# EAGLE design xiaogyan.v1.1 (EAGLE 7.7.0)
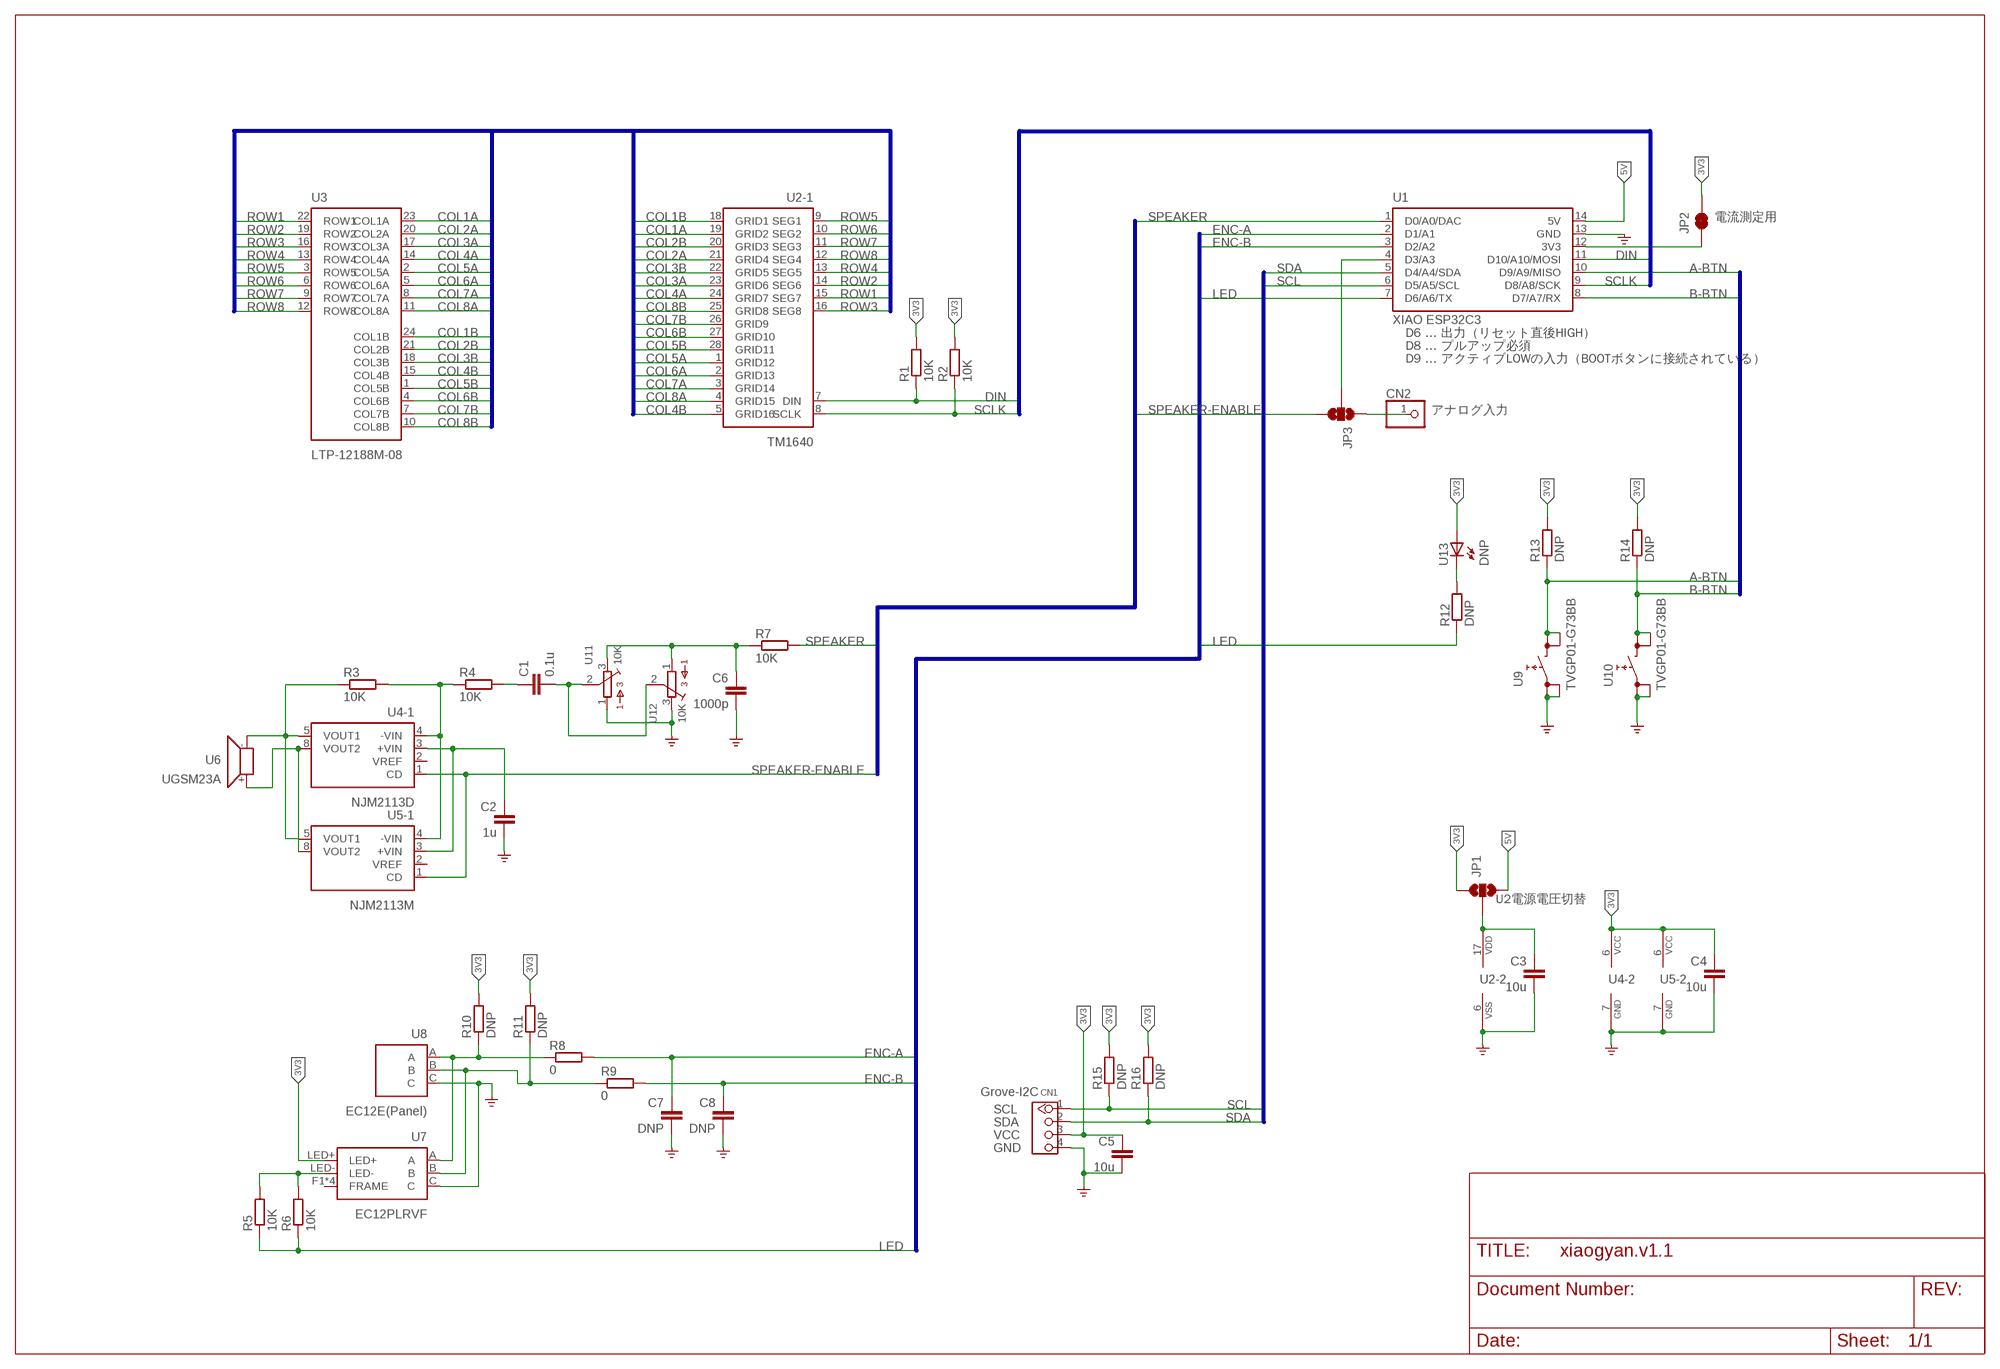
[diagram p0: schematic, sheet 1]

## Parts
C1  0.1u  C-EUC0603  [C0603]
C2  1u  C-EUC0603  [C0603]
C3  10u  C-EUC0603  [C0603]
C4  10u  C-EUC0603  [C0603]
C5  10u  C-EUC0603  [C0603]
C6  1000p  C-EUC0805  [C0805]
C7  DNP  C-EUC0603  [C0603]
C8  DNP  C-EUC0603  [C0603]
CN1  4P-2.0  GROVE-CONNECTOR-DIP(4P-2.0)  [HW4-2.0]
CN2  PINHD-1X1  [1X01]
JP1  JUMPER-SMT_3_NO_SILK  [SMT-JUMPER_3_NO_SILK]
JP2  JUMPER-SMT_2_NC_TRACE_SILK  [SMT-JUMPER_2_NC_TRACE_SILK]
JP3  JUMPER-SMT_3_NO_SILK  [SMT-JUMPER_3_NO_SILK]
R1  10K  R-EU_R0603  [R0603]
R2  10K  R-EU_R0603  [R0603]
R3  10K  R-EU_R0603  [R0603]
R4  10K  R-EU_R0603  [R0603]
R5  10K  R-EU_R0603  [R0603]
R6  10K  R-EU_R0603  [R0603]
R7  10K  R-EU_R0603  [R0603]
R8  0  R-EU_R0603  [R0603]
R9  0  R-EU_R0603  [R0603]
R10  DNP  R-EU_R0603  [R0603]
R11  DNP  R-EU_R0603  [R0603]
R12  DNP  R-EU_R0603  [R0603]
R13  DNP  R-EU_R0603  [R0603]
R14  DNP  R-EU_R0603  [R0603]
R15  DNP  R-EU_R0603  [R0603]
R16  DNP  R-EU_R0603  [R0603]
U1  XIAO ESP32C3  SEEEDUINOXIAO  [SEEEDUINOXIAO]
U2  TM1640  [TM1640]
U3  LTP-12188M-08  [LTP-12188M]
U4  NJM2113D  [DIL08]
U5  NJM2113M  [SO08]
U6  UGSM23A  [UGSM23A]
U7  EC12PLRVF  [EC12PLRVF]
U8  EC12E(Panel)  EC12EPANEL  [EC12E_PANEL]
U9  TVGP01-G73BB  [TVGP01-G73BB]
U10  TVGP01-G73BB  [TVGP01-G73BB]
U11  10K  3386-K  [3386K]
U12  10K  3386-T  [3386T]
U13  DNP  LED5MM  [LED5MM]

## Nets
3V3: C4.1 C5.1 CN1.3 JP1.1 JP2.2 R1.2 R2.2 R10.2 R11.2 R13.2 R14.2 R15.2 R16.2 U4.6(-2:VCC) U5.6(-2:VCC) U7.LED+ U13.A
5V: JP1.3 U1.14(5V)
A-BTN: R13.1 U1.10(D9/A9/MISO) U9.3 U9.4
B-BTN: R14.1 U1.8(D7/A7/RX) U10.3 U10.4
COL1A: U2.19(-1:GRID2) U3.23(COL1A)
COL1B: U2.18(-1:GRID1) U3.24(COL1B)
COL2A: U2.21(-1:GRID4) U3.20(COL2A)
COL2B: U2.20(-1:GRID3) U3.21(COL2B)
COL3A: U2.23(-1:GRID6) U3.17(COL3A)
COL3B: U2.22(-1:GRID5) U3.18(COL3B)
COL4A: U2.24(-1:GRID7) U3.14(COL4A)
COL4B: U2.5(-1:GRID16) U3.15(COL4B)
COL5A: U2.1(-1:GRID12) U3.2(COL5A)
COL5B: U2.28(-1:GRID11) U3.1(COL5B)
COL6A: U2.2(-1:GRID13) U3.5(COL6A)
COL6B: U2.27(-1:GRID10) U3.4(COL6B)
COL7A: U2.3(-1:GRID14) U3.8(COL7A)
COL7B: U2.26(-1:GRID9) U3.7(COL7B)
COL8A: U2.4(-1:GRID15) U3.11(COL8A)
COL8B: U2.25(-1:GRID8) U3.10(COL8B)
DIN: R1.1 U1.11(D10/A10/MOSI) U2.7(-1:DIN)
ENC-A: C7.1 R8.2 U1.2(D1/A1)
ENC-B: C8.1 R9.2 U1.3(D2/A2)
GND: C2.2 C3.2 C4.2 C5.2 C6.2 C7.2 C8.2 CN1.4 U1.13(GND) U2.6(-2:VSS) U4.7(-2:GND) U5.7(-2:GND) U7.C U8.C U9.1 U9.2 U10.1 U10.2 U11.1 U12.3 ; supply symbol labelled GND_POWER
LED: R5.1 R6.1 R12.1 U1.7(D6/A6/TX)
N$1: R3.1 U4.5(-1:VOUT1) U5.5(-1:VOUT1) U6.-
N$2: R3.2 R4.1 U4.4(-1:-VIN) U5.4(-1:-VIN)
N$3: U4.8(-1:VOUT2) U5.8(-1:VOUT2) U6.+
N$4: C1.1 R4.2
N$5: C2.1 U4.3(-1:+VIN) U5.3(-1:+VIN)
N$6: R5.2 R6.2 U7.LED-
N$7: R8.1 R10.1 U7.A U8.A
N$8: C1.2 U11.2 U12.2
N$9: R9.1 R11.1 U7.B U8.B
N$10: C6.1 R7.1 U11.3 U12.1
N$11: R12.2 U13.K(C)
N$12: JP3.2 U1.4(D3/A3)
N$13: C3.1 JP1.2 U2.17(-2:VDD)
N$15: JP2.1 U1.12(3V3)
N$16: CN2.1 JP3.1
ROW1: U2.15(-1:SEG7) U3.22(ROW1)
ROW2: U2.14(-1:SEG6) U3.19(ROW2)
ROW3: U2.16(-1:SEG8) U3.16(ROW3)
ROW4: U2.13(-1:SEG5) U3.13(ROW4)
ROW5: U2.9(-1:SEG1) U3.3(ROW5)
ROW6: U2.10(-1:SEG2) U3.6(ROW6)
ROW7: U2.11(-1:SEG3) U3.9(ROW7)
ROW8: U2.12(-1:SEG4) U3.12(ROW8)
SCL: CN1.1 R15.1 U1.6(D5/A5/SCL)
SCLK: R2.1 U1.9(D8/A8/SCK) U2.8(-1:SCLK)
SDA: CN1.2 R16.1 U1.5(D4/A4/SDA)
SPEAKER: R7.2 U1.1(D0/A0/DAC)
SPEAKER-ENABLE: JP3.3 U4.1(-1:CD) U5.1(-1:CD)
Unconnected: U4.2(-1:VREF) U5.2(-1:VREF) U7.F1(FRAME) U7.F2(FRAME) U7.F3(FRAME) U7.F4(FRAME)

## Buses
DIN,SCLK
ROW[1..8],COL1A,COL2A,COL3A,COL4A,COL5A,COL6A,COL7A,COL8A,COL1B,COL2B,COL3B,COL4B,COL5B,COL6B,COL7B,COL8B
SPEAKER,SPEAKER-ENABLE
ENC-A,ENC-B,LED
A-BTN,B-BTN
SCL,SDA

## Notes on the sheet
- 電流測定用
- D6 ... 出力（リセット直後HIGH）
- D8 ... プルアップ必須
- D9 ... アクティブLOWの入力（BOOTボタンに接続されている）
- アナログ入力
- U2電源電圧切替
- Grove-I2C
- SCL
- SDA
- VCC
- GND

## Library data of the parts
C1-C8 = rcl:C-EU: CAPACITOR, European symbol
CN1 = Seeed-Connector:GROVE-CONNECTOR-DIP(4P-2.0): 320110033
CN2 = pinhead:PINHD-1X1: PIN HEADER
JP1 JP3 = SparkFun-Jumpers:JUMPER-SMT_3_NO: Normally open jumper This jumper has three pads in close proximity to each other. Apply solder to close the connection(s).
JP2 = SparkFun-Jumpers:JUMPER-SMT_2_NC_TRACE: Normally closed trace jumper This jumper has a trace between two pads so it's normally closed (NC). Use a razor knife to open the connection. For best results follow the IPC guidelines for cutting traces: Cutout at least 0.063 mm (0.005 in). Remove all loose material to clean up the cut area. Seal the cut with an approved epoxy. Reapply solder to reclose the connection.
R1-R16 = rcl:R-EU_: RESISTOR, European symbol
U1 = matsujirushi:SEEEDUINOXIAO
U2 = matsujirushi:TM1640; OC_AKIZUKI: I-13225
U3 = matsujirushi:LTP-12188M; OC_AKIZUKI: I-09878
U4 = matsujirushi:NJM2113; OC_AKIZUKI: I-11192
U5 = matsujirushi:NJM2113
U6 = matsujirushi:UGSM23A; OC_AKIZUKI: P-09797
U7 = matsujirushi:EC12PL*VF; OC_AKIZUKI: P-05762
U8 = matsujirushi:EC12E
U9 U10 = matsujirushi:TVGP01-G73BB; OC_AKIZUKI: P-12226
U11 U12 = pot-suntan:3386-: Trimming Potentiometer Suntan TSR-3386 Series 8 Terminal Square Trimming Potentiometer
U13 = led:LED: LED OSRAM: - CHIPLED LG R971, LG N971, LY N971, LG Q971, LY Q971, LO R971, LY R971 LH N974, LH R974 LS Q976, LO Q976, LY Q976 LO Q996 - Hyper CHIPLED LW Q18S LB Q993, LB Q99A, LB R99A - SideLED LS A670, LO A670, LY A670, LG A670, LP A670 LB A673, LV A673, LT A673, LW A673 LH A674 LY A675 LS A676, LA A676, LO A676, LY A676, LW A676 LS A679, LY A679, LG A679 - Hyper Micro SIDELED® LS Y876, LA Y876, LO Y876, LY Y876 LT Y87S - SmartLED LW L88C, LW L88S LB L89C, LB L89S, LG L890 LS L89K, LO L89K, LY L89K LS L896, LA L896, LO L896, LY L896 - TOPLED LS T670, LO T670, LY T670, LG T670, LP T670 LSG T670, LSP T670, LSY T670, LOP T670, LYG T670 LG T671, LOG T671, LSG T671 LB T673, LV T673, LT T673, LW T673 LH T674 LS T676, LA T676, LO T676, LY T676, LB T676, LH T676, LSB T676, LW T676 LB T67C, LV T67C, LT T67C, LS T67K, LO T67K, LY T67K, LW E67C LS E67B, LA E67B, LO E67B, LY E67B, LB E67C, LV E67C, LT E67C LW T67C LS T679, LY T679, LG T679 LS T770, LO T770, LY T770, LG T770, LP T770 LB T773, LV T773, LT T773, LW T773 LH T774 LS E675, LA E675, LY E675, LS T675 LS T776, LA T776, LO T776, LY T776, LB T776 LHGB T686 LT T68C, LB T68C - Hyper Mini TOPLED® LB M676 - Mini TOPLED Santana® LG M470 LS M47K, LO M47K, LY M47K Source: http://www.osram.convergy.de LUXEON: - LUMILED® LXK2-PW12-R00, LXK2-PW12-S00, LXK2-PW14-U00, LXK2-PW14-V00 LXK2-PM12-R00, LXK2-PM12-S00, LXK2-PM14-U00 LXK2-PE12-Q00, LXK2-PE12-R00, LXK2-PE12-S00, LXK2-PE14-T00, LXK2-PE14-U00 LXK2-PB12-K00, LXK2-PB12-L00, LXK2-PB12-M00, LXK2-PB14-N00, LXK2-PB14-P00, LXK2-PB14-Q00 LXK2-PR12-L00, LXK2-PR12-M00, LXK2-PR14-Q00, LXK2-PR14-R00 LXK2-PD12-Q00, LXK2-PD12-R00, LXK2-PD12-S00 LXK2-PH12-R00, LXK2-PH12-S00 LXK2-PL12-P00, LXK2-PL12-Q00, LXK2-PL12-R00 Source: www.luxeon.com KINGBRIGHT: KA-3528ASYC Source: www.kingbright.com

## Board
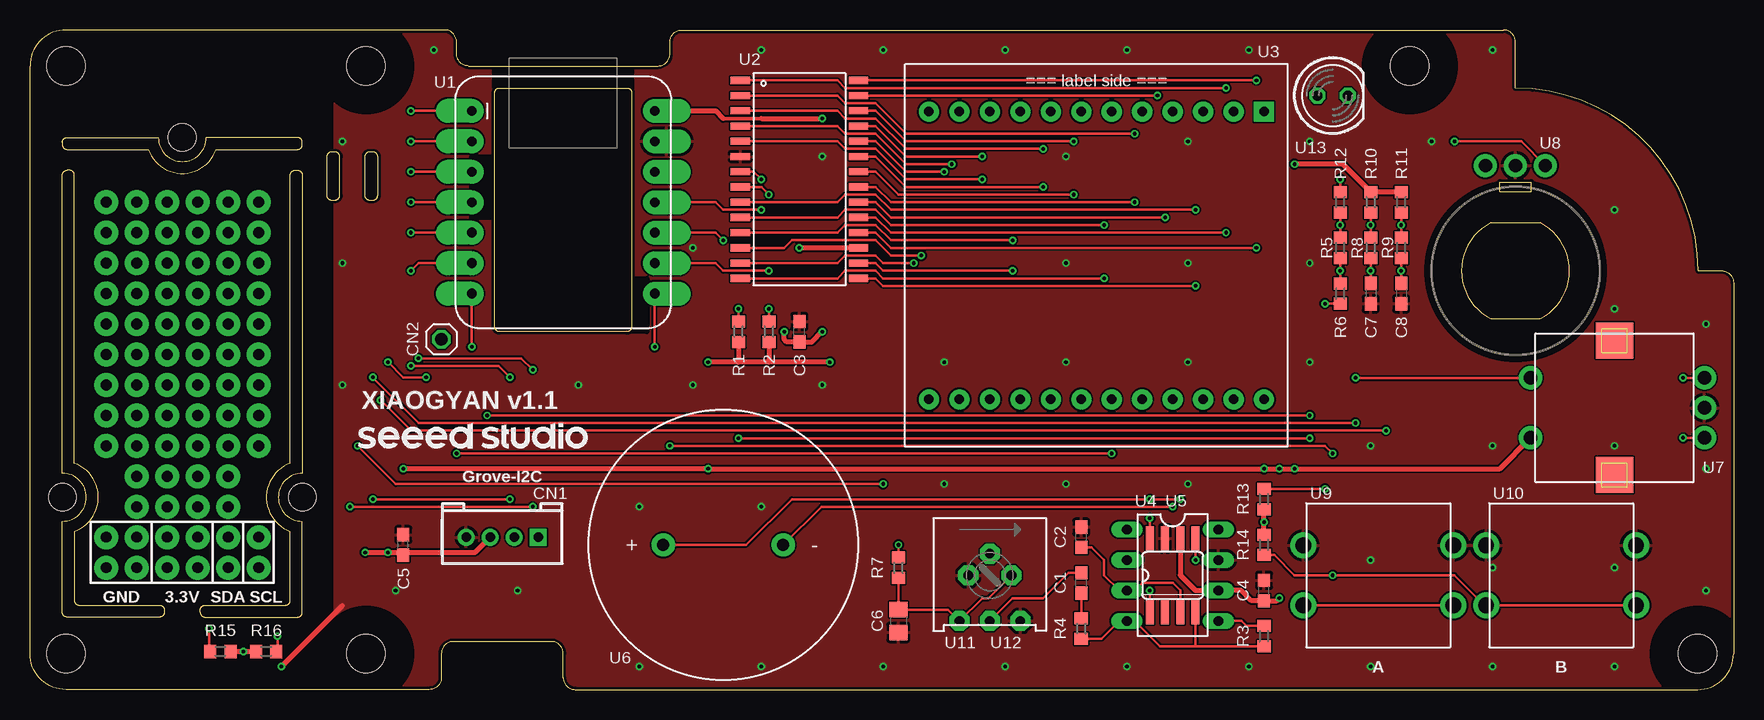
[diagram p1: board, top side]
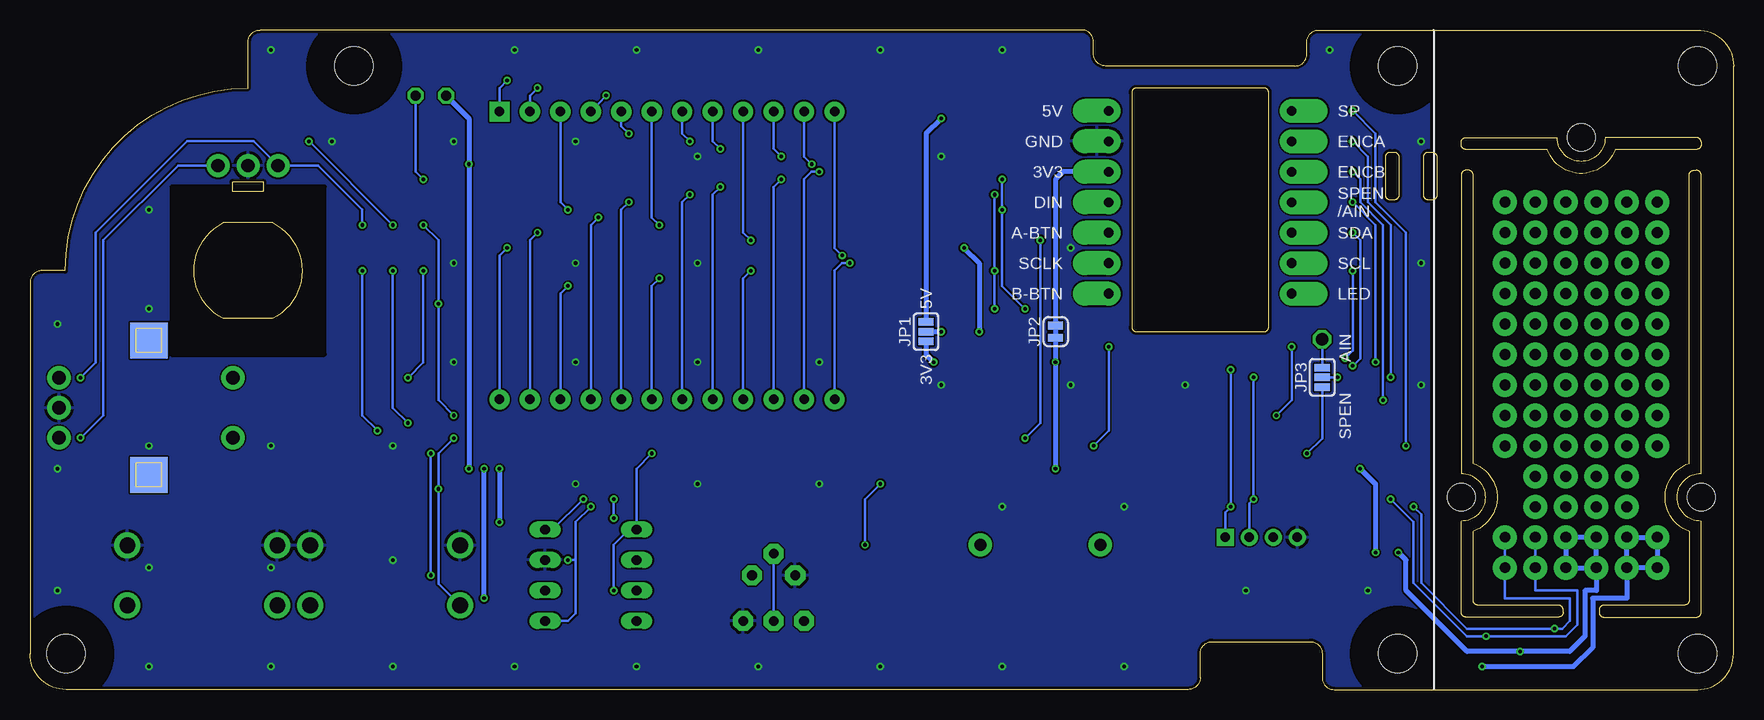
[diagram p2: board, bottom side, seen from below]

Size 142 x 55 mm. Coordinates in mm from the lower left corner, seen from the top.
Outline: 123.83,50.16 123.83,54 arc90 122.83,55 54.34,55 arc90 53.34,54 53.34,53 arc-90 52.34,52 36.56,52 arc-90 35.56,53 35.56,54 arc90 34.56,55 3,55 arc90 0,52 0,3 arc90 3,0 33.29,0 arc90 34.29,1 34.29,3 arc-90 35.29,4 43.45,4 arc-90 44.45,3 44.45,1 arc90 45.45,0 139,0 arc90 142,3 142,33.92 arc90 141,34.92 139.06,34.92 arc90 123.83,50.16
Outline: 2.7,45.63 2.7,45.44 arc90 3.1,45.03 9.87,45.03 arc141 15.53,45.03 22.3,45.03 arc90 22.7,45.44 22.7,45.63 arc90 22.3,46.03 14.7,46.03 arc-180 10.7,46.03 3.1,46.03 arc90 2.7,45.63
Outline: 11.2,6.63 11.2,6.43 arc-90 10.8,6.04 3.1,6.04 arc-90 2.7,6.43 2.7,14.04 arc180 2.7,18.04 2.7,42.91 arc-90 3.1,43.3 3.3,43.3 arc-90 3.7,42.91 3.7,18.86 arc-141 3.7,13.21 3.7,7.43 arc90 4.1,7.04 10.8,7.04 arc-90 11.2,6.63
Outline: 14.6,6.04 22.3,6.04 arc90 22.7,6.43 22.7,14.04 arc-180 22.7,18.04 22.7,42.91 arc90 22.3,43.3 22.1,43.3 arc90 21.7,42.91 21.7,18.86 arc141 21.7,13.21 21.7,7.43 arc-90 21.3,7.04 14.6,7.04 arc90 14.2,6.63 14.2,6.43 arc90 14.6,6.04
Outline: 24.73,44.42 24.73,41.23 arc90 25.13,40.83 25.43,40.83 arc90 25.83,41.23 25.83,44.42 arc90 25.43,44.83 25.13,44.83 arc90 24.73,44.42
Outline: 28.3,40.83 28.6,40.83 arc90 29,41.23 29,44.42 arc90 28.6,44.83 28.3,44.83 arc90 27.9,44.42 27.9,41.23 arc90 28.3,40.83
Outline: 50.16,49.77 50.16,30.25 arc-90 49.77,29.84 39.13,29.84 arc-90 38.73,30.25 38.73,49.77 arc-90 39.13,50.16 49.77,50.16 arc-90 50.16,49.77
Copper layers (1*16): Top 0.035mm / dielectric 1.5mm / Bottom 0.035mm
Design rules "SeeedStudio_2layer_DRU_no_angle_20140221": minimum track width 6mil, minimum drill 12mil, track to track 6mil, track to pad 6mil, pad to pad 6mil, via to via 6mil, smd to smd 0mil, copper to edge 10mil, drill to drill 10mil, minimum pad ring 10mil, minimum via ring 6mil, stop-mask expansion 2mil, vias tented up to drill 100mil, thermal gap 10mil
Holes 2.3 mm at 12.7,46.03 2.7,16.04 22.7,16.04
Holes 3.2 mm at 3,3 3,52 28,3 28,52 115,52 139,3
tRestrict: area 111,48 to 119,56; area 135,-1 to 143,7; area 24,-1 to 32,7; area 24,48 to 32,56; area 38.7,50.2 to 50.2,52.1; area 36.8,39.4 to 38.7,44.5; area 49.5,29.8 to 51.4,34.3; area 116.3,27.4 to 131.3,42.4
bRestrict: area 117.5,27.9 to 130.2,41.9; area 24,-1 to 32,7; area 24,48 to 32,56; area 111,48 to 119,56; area 135,-1 to 143,7

### Footprints (pad centres in the part's own frame; a part is rotated, then mirrored left to right if it is on the bottom)
C0603 = smd 1.1 x 1: 1 -0.85,0; 2 0.85,0
C0805 = smd 1.3 x 1.5: 1 -0.95,0; 2 0.95,0
HW4-2.0 = drill 0.8 pad 1.422 square: 1 -3,0 | drill 0.8 pad 1.422: 2 -1,0; 3 1,0; 4 3,0
1X01 = drill 1.016 octagon: 1 0,0
SMT-JUMPER_3_NO_SILK = smd 0.635 x 1.27: 1 -0.813,0; 2 0,0; 3 0.813,0
SMT-JUMPER_2_NC_TRACE_SILK = smd 0.635 x 1.27: 1 -0.508,0; 2 0.508,0
R0603 = smd 1 x 1.1: 1 -0.85,0; 2 0.85,0
SEEEDUINOXIAO = drill 0.8 pad 2 offset: 1 -7.62,7.62; 2 -7.62,5.08; 3 -7.62,2.54; 4 -7.62,0; 5 -7.62,-2.54; 6 -7.62,-5.08; 7 -7.62,-7.62; 8 7.62,-7.62; 9 7.62,-5.08; 10 7.62,-2.54; 11 7.62,0; 12 7.62,2.54; 13 7.62,5.08; 14 7.62,7.62
TM1640 = smd 0.6 x 1.6: 1 -8.255,-4.925; 2 -6.985,-4.925; 3 -5.715,-4.925; 4 -4.445,-4.925; 5 -3.175,-4.925; 6 -1.905,-4.925; 7 -0.635,-4.925; 8 0.635,-4.925; 9 1.905,-4.925; 10 3.175,-4.925; 11 4.445,-4.925; 12 5.715,-4.925; 13 6.985,-4.925; 14 8.255,-4.925; 15 8.255,4.925; 16 6.985,4.925; 17 5.715,4.925; 18 4.445,4.925; 19 3.175,4.925; 20 1.905,4.925; 21 0.635,4.925; 22 -0.635,4.925; 23 -1.905,4.925; 24 -3.175,4.925; 25 -4.445,4.925; 26 -5.715,4.925; 27 -6.985,4.925; 28 -8.255,4.925
LTP-12188M = drill 0.8 pad 1.676 square: 1 -13.97,-12 | drill 0.8 pad 1.676: 2 -11.43,-12; 3 -8.89,-12; 4 -6.35,-12; 5 -3.81,-12; 6 -1.27,-12; 7 1.27,-12; 8 3.81,-12; 9 6.35,-12; 10 8.89,-12; 11 11.43,-12; 12 13.97,-12; 13 13.97,12; 14 11.43,12; 15 8.89,12; 16 6.35,12; 17 3.81,12; 18 1.27,12; 19 -1.27,12; 20 -3.81,12; 21 -6.35,12; 22 -8.89,12; 23 -11.43,12; 24 -13.97,12
DIL08 = drill 0.813 long: 1 -3.81,-3.81; 2 -1.27,-3.81; 3 1.27,-3.81; 4 3.81,-3.81; 5 3.81,3.81; 6 1.27,3.81; 7 -1.27,3.81; 8 -3.81,3.81
SO08 = smd 0.66 x 2.032: 1 -1.905,-3.073; 2 -0.635,-3.073; 3 0.635,-3.073; 4 1.905,-3.073; 5 1.905,3.073; 6 0.635,3.073; 7 -0.635,3.073; 8 -1.905,3.073
UGSM23A = drill 1 pad 1.93: + 0,5; - 0,-5
EC12PLRVF = drill 1.1 pad 1.93: A -2.5,-7.5; B 2.5,-7.5; C 0,-7.5; LED+ -2.5,7; LED- 2.5,7 | smd 3 x 3.1: F1 -5.6,0; F3 5.6,0 | smd 3 x 3.1 bottom: F2 -5.6,0; F4 5.6,0
EC12E_PANEL = drill 1.1 pad 1.93: A -2.5,-8.77; B 2.5,-8.77; C 0,-8.77
TVGP01-G73BB = drill 1.3 pad 2.184: 1 -6.25,2.5; 2 6.25,2.5; 3 -6.25,-2.5; 4 6.25,-2.5
3386K = drill 0.813 pad 1.676 octagon: 1 -1.8,0; 2 0,1.8; 3 1.8,0
3386T = drill 0.813 pad 1.676 octagon: 1 -2.54,-3.81; 2 0,-3.81; 3 2.54,-3.81
LED5MM = drill 0.813 octagon: A -1.27,0; K 1.27,0

### Placement (x,y rotation side)
C1  87.63,8.89 90 top
C2  87.63,12.7 90 top
C3  64.14,29.84 90 top
C4  102.87,8.26 90 top
C5  31.11,12.06 90 top
C6  72.39,5.71 270 top
C7  111.76,33.02 270 top
C8  114.3,33.02 270 top
CN1  39.37,12.7 180 top
CN2  34.29,29.21 0 top
JP1  67.31,29.84 90 bottom
JP2  56.52,29.84 270 bottom
JP3  34.29,26.04 270 bottom
R1  59.05,29.84 270 top
R2  61.59,29.84 270 top
R3  102.87,4.45 270 top
R4  87.63,5.08 90 top
R5  109.22,36.83 270 top
R6  109.22,33.02 90 top
R7  72.39,10.16 90 top
R8  111.76,36.83 270 top
R9  114.3,36.83 270 top
R10  111.76,40.64 90 top
R11  114.3,40.64 90 top
R12  109.22,40.64 90 top
R13  102.87,15.88 270 top
R14  102.87,12.06 90 top
R15  15.88,3.17 0 top
R16  19.68,3.17 180 top
U1  44.45,40.64 0 top
U2  64.14,42.55 270 top
U3  88.9,36.2 180 top
U4  95.25,9.53 270 top
U5  95.25,9.53 0 top
U6  57.78,12.06 90 top
U7  132.08,23.5 90 top
U8  123.83,34.92 180 top
U9  112.39,9.53 0 top
U10  127.64,9.53 0 top
U11  80.01,9.53 0 top
U12  80.01,9.53 0 top
U13  108.58,49.53 0 top

### Tracks (layer width: path | path; a pad name or v marks a point on that pad's centre or on a via)
3V3  (via drill 0.3, 0.9 pad 2)
  Top 0.406: v66.67,27.3 61.59,27.3 | 61.59,27.3 59.05,27.3 | 59.05,27.3 v56.52,27.3 | R1.2 59.05,27.3 | R2.2 61.59,27.3 | v31.11,18.41 v56.52,18.41 v102.87,18.41 v104.14,18.41 v105.41,18.41 122.5,18.41 U7.LED+ | R14.2 v102.87,13.97 R13.2 | v104.14,7.62 103.92,7.41 C4.1 101.81,7.41 100.97,8.26 U4.6 97.16,8.26 95.89,9.53 U5.6 | R11.2 R10.2 109.44,43.81 v105.41,43.81 | R15.2 v17.78,3.17 R16.2 | CN1.3 37.1,11.43 31.11,11.43 | v27.94,11.43 v29.84,11.43 31.11,11.43 | C5.1 31.11,11.43
  Bottom 0.406: JP2.2 v56.52,27.3 v56.52,18.41 | JP1.1 67.31,27.94 v66.67,27.3 | v102.87,18.41 v102.87,13.97 | v104.14,7.62 v104.14,18.41 | U13.A 105.41,47.62 v105.41,43.81 v105.41,18.41 | v11.43,10.16 11.43,8.26 12.38,8.26 12.38,4.45 13.65,3.17 v17.78,3.17 22.23,3.17 27.3,8.26 27.3,10.79 v27.94,11.43 | v11.43,10.16 v11.43,12.7 v13.97,12.7 v13.97,10.16 v11.43,10.16 | v31.11,18.41 29.84,17.14 v29.84,11.43
5V  (via drill 0.3)
  Top 0.305: 57.78,47.62 60.96,47.62
  Top 0.406: U1.14 57.15,48.26 57.78,47.62 | 60.96,47.62 v66.04,47.62
  Bottom 0.406: v66.04,47.62 67.31,46.35 JP1.3
A-BTN  (via drill 0.3)
  Top 0.203: v106.68,20.95 v59.05,20.95 | U9.4 U9.3 | R13.1 v107.95,16.73 | v57.78,37.47 57.15,38.1 U1.10
  Bottom 0.203: U9.3 107.95,8.83 v107.95,16.73 107.95,19.68 v106.68,20.95 | v59.05,20.95 57.78,22.23 v57.78,37.47
B-BTN  (via drill 0.3)
  Top 0.203: U10.4 U10.3 121.25,7.03 118.75,9.53 v108.58,9.53 105.41,9.53 103.72,11.21 R14.1 | v108.58,19.68 107.95,20.32 v53.34,20.32 | v52.07,28.57 U1.8
  Bottom 0.203: v108.58,9.53 v108.58,19.68 | v53.34,20.32 52.07,21.59 v52.07,28.57
COL1A  (via drill 0.3)
  Top 0.203: U2.19 70.48,39.37 71.75,38.1 v99.69,38.1
  Bottom 0.203: v99.69,38.1 100.33,37.47 U3.23
COL1B  (via drill 0.3)
  Top 0.203: v102.23,36.83 71.75,36.83 70.48,38.1 U2.18
  Bottom 0.203: U3.24 102.87,36.2 v102.23,36.83
COL2A  (via drill 0.3)
  Top 0.203: v92.08,40.64 71.75,40.64 70.48,41.91 U2.21
  Bottom 0.203: U3.20 92.71,40.01 v92.08,40.64
COL2B  (via drill 0.3)
  Top 0.203: v94.61,39.37 71.75,39.37 70.48,40.64 U2.20
  Bottom 0.203: U3.21 95.25,38.73 v94.61,39.37
COL3A  (via drill 0.3)
  Top 0.203: v84.45,41.91 73.03,41.91 70.48,44.45 U2.23
  Bottom 0.203: v84.45,41.91 85.09,41.27 U3.17
COL3B  (via drill 0.3)
  Top 0.203: v87,41.27 72.39,41.27 70.48,43.18 U2.22
  Bottom 0.203: U3.18 87.63,40.64 v87,41.27
COL4A  (via drill 0.3)
  Top 0.203: v76.2,43.18 73.03,43.18 70.48,45.72 U2.24
  Bottom 0.203: U3.14 77.47,42.55 76.83,43.18 v76.2,43.18
COL4B  (via drill 0.3)
  Top 0.203: v79.38,42.55 73.03,42.55 70.48,45.09 67.94,45.09 67.31,45.72 U2.5
  Bottom 0.203: U3.15 80.01,41.91 v79.38,42.55
COL5A  (via drill 0.3)
  Top 0.203: v99.69,50.16 67.94,50.16 67.31,50.8 U2.1
  Bottom 0.203: U3.2 100.33,49.53 v99.69,50.16
COL5B  (via drill 0.3)
  Top 0.203: v102.23,50.8 U2.28
  Bottom 0.203: U3.1 102.87,50.16 v102.23,50.8
COL6A  (via drill 0.3)
  Top 0.203: v92.08,46.35 73.03,46.35 70.48,48.9 67.94,48.9 67.31,49.53 U2.2
  Bottom 0.203: U3.5 92.71,46.99 v92.08,46.35
COL6B  (via drill 0.3)
  Top 0.203: v93.98,49.53 U2.27
  Bottom 0.203: U3.4 v93.98,49.53
COL7A  (via drill 0.3)
  Top 0.203: v84.45,45.09 73.03,45.09 70.48,47.62 67.94,47.62 67.31,48.26 U2.3
  Bottom 0.203: U3.8 85.09,45.72 v84.45,45.09
COL7B  (via drill 0.3)
  Top 0.203: v87,45.72 73.03,45.72 70.48,48.26 U2.26
  Bottom 0.203: U3.7 87.63,46.35 v87,45.72
COL8A  (via drill 0.3)
  Top 0.203: v76.83,43.81 73.03,43.81 70.48,46.35 67.94,46.35 67.31,46.99 U2.4
  Bottom 0.203: U3.11 77.47,44.45 v76.83,43.81
COL8B  (via drill 0.3)
  Top 0.203: v79.38,44.45 73.03,44.45 70.48,46.99 U2.25
  Bottom 0.203: U3.10 80.01,45.09 v79.38,44.45
DIN  (via drill 0.3)
  Top 0.203: U1.11 57.15,40.64 57.78,40.01 v60.96,40.01 | v60.96,42.55 60.33,43.18 U2.7 | v59.05,31.75 R1.1
  Bottom 0.203: v60.96,42.55 v60.96,40.01 60.96,33.66 v59.05,31.75
ENC-A  (via drill 0.3)
  Top 0.203: R8.2 v111.76,34.92 C7.1 | v110.49,22.23 32.38,22.23 v28.57,26.04 | v31.75,45.72 U1.2
  Bottom 0.203: v111.76,34.92 111.76,23.5 v110.49,22.23 | v28.57,26.04 28.57,38.73 30.48,40.64 30.48,44.45 v31.75,45.72
ENC-B  (via drill 0.3)
  Top 0.203: R9.2 v114.3,34.92 C8.1 | v113.03,21.59 31.75,21.59 v29.21,24.13 | v31.75,43.18 U1.3
  Bottom 0.203: v114.3,34.92 114.3,22.86 v113.03,21.59 | v29.21,24.13 29.21,38.73 31.11,40.64 31.11,42.55 v31.75,43.18
GND  (via drill 0.3, 0.9 pad 2)
  Top 0.406: v20.95,1.91 26.04,6.99
  Bottom 0.406: v8.89,10.16 8.89,7.62 11.75,7.62 11.75,3.49 13.34,1.91 v20.95,1.91 | v8.89,10.16 v6.35,10.16 v6.35,12.7 v8.89,12.7 v8.89,10.16
  other vias: 55.24,36.83 66.04,44.45 33.66,53.34 26.04,45.72 26.04,35.56 26.04,25.4 45.72,25.4 55.24,25.4 66.04,25.4 40.64,8.26 30.48,8.26 50.8,15.24 60.96,15.24 50.8,1.91 60.96,1.91 76.2,17.14 71.12,1.91 81.28,1.91 86.36,17.14 91.44,1.91 96.52,17.14 101.6,1.91 111.76,1.91 111.76,10.79 76.2,27.3 86.36,27.3 96.52,27.3 106.68,27.3 96.52,35.56 86.36,35.56 121.92,1.91 121.92,10.16 132.08,10.16 132.08,1.91 139.7,8.26 111.76,20.32 121.92,20.32 132.08,20.32 139.7,18.41 139.7,30.48 132.08,31.75 132.08,40.01 106.68,35.56 116.84,45.72 106.68,45.72 121.92,53.34 101.6,53.34 96.52,45.72 86.36,44.45 91.44,53.34 81.28,53.34 71.12,53.34 60.96,53.34
  pour Bottom: 25.41,0 142,0 142,55 25.41,55
  pour Top: 25.41,0 142,0 142,55 25.41,55
LED  (via drill 0.3)
  Top 0.203: R5.1 v109.22,38.73 R12.1 | v106.68,22.86 v38.1,22.86 | v36.83,28.57 U1.7 | v107.95,32.17 R6.1
  Bottom 0.203: v109.22,38.73 107.95,37.47 v107.95,32.17 107.95,24.13 v106.68,22.86 | v38.1,22.86 36.83,24.13 v36.83,28.57
N$1  (via drill 0.3)
  Top 0.203: v95.25,15.24 65.96,15.24 U6.- | R3.1 101.39,5.29 100.97,5.71 U4.5 | U5.5 v97.16,10.79
  Bottom 0.203: v95.25,15.24 96.52,13.97 96.52,10.79 | 96.52,10.79 96.52,6.35 97.16,5.71 U4.5 | v97.16,10.79 96.52,10.79
N$2
  Top 0.203: 97.16,3.6 94.19,3.6 92.08,5.71 U4.4 90.81,5.71 89.32,4.23 R4.1 | 97.16,3.6 R3.2 | U5.4 97.16,3.6
N$3  (via drill 0.3)
  Top 0.203: v95.89,15.88 v93.34,15.88 63.5,15.88 59.69,12.06 U6.+ | U5.8 v93.34,14.29
  Bottom 0.203: v95.89,15.88 98.42,13.34 U4.8 | v93.34,14.29 v93.34,15.88
N$4
  Top 0.203: R4.2 C1.1
N$5
  Top 0.203: C2.1 88.48,11.85 89.53,10.79 89.53,9.53 90.81,8.26 U4.3 92.08,8.26 92.71,8.89 95.25,8.89 95.89,8.26 U5.3
N$6  (via drill 0.3)
  Top 0.203: R5.2 v109.22,34.92 R6.2 | v110.49,26 U7.LED-
  Bottom 0.203: v109.22,34.92 109.22,27.27 v110.49,26
N$7  (via drill 0.3)
  Top 0.203: R10.1 v111.76,38.73 R8.1 | v118.75,45.72 124.3,45.72 U8.A | v137.79,21 U7.A
  Bottom 0.203: v111.76,38.73 v118.75,45.72 | v137.79,21 137.75,21 135.89,22.86 135.89,37.47 129.66,43.7 U8.A
N$8
  Top 0.203: C1.2 86.58,9.74 84.45,7.62 81.92,7.62 U12.2
  Bottom 0.203: U11.2 U12.2
N$9  (via drill 0.3)
  Top 0.203: R11.1 v114.3,38.73 R9.1 | v137.79,26 U7.B
  Bottom 0.203: v114.3,38.73 114.3,40.01 117.99,43.7 U8.B 123.35,45.72 128.91,45.72 136.53,38.1 136.53,27.27 v137.79,26
N$10
  Top 0.203: R7.1 C6.1 76.52,6.67 U12.1 79.38,7.62 79.91,7.62 U11.3
N$11  (via drill 0.3)
  Top 0.203: R12.2 v109.22,42.55
  Bottom 0.203: U13.K 109.86,43.18 v109.22,42.55
N$12  (via drill 0.3)
  Top 0.203: v31.75,40.64 U1.4 | v33.02,26.04 31.11,26.04 v29.84,27.3
  Bottom 0.203: v29.84,27.3 29.84,38.73 v31.75,40.64 | v33.02,26.04 JP3.2
N$13  (via drill 0.3)
  Top 0.406: U2.17 v64.14,36.83 | v62.87,29.84 62.87,29.21 63.08,29 C3.1 65.19,29 v66.04,29.84
  Bottom 0.406: v64.14,36.83 62.87,35.56 v62.87,29.84 | JP1.2 v66.04,29.84
N$14
  Bottom 0.406: 56.52,30.48 56.52,29.21
N$15
  Bottom 0.406: U1.12 55.88,43.18 56.52,42.55 JP2.1
N$16
  Bottom 0.203: CN2.1 JP3.1
N$26  (via drill 0.9 pad 2)
  other vias: 16.51,15.24
N$27  (via drill 0.9 pad 2)
  other vias: 13.97,15.24
N$28  (via drill 0.9 pad 2)
  other vias: 11.43,15.24
N$29  (via drill 0.9 pad 2)
  other vias: 8.89,15.24
N$32  (via drill 0.9 pad 2)
  other vias: 8.89,17.78
N$33  (via drill 0.9 pad 2)
  other vias: 11.43,17.78
N$34  (via drill 0.9 pad 2)
  other vias: 13.97,17.78
N$35  (via drill 0.9 pad 2)
  other vias: 16.51,17.78
N$36  (via drill 0.9 pad 2)
  other vias: 6.35,20.32
N$37  (via drill 0.9 pad 2)
  other vias: 8.89,20.32
N$38  (via drill 0.9 pad 2)
  other vias: 11.43,20.32
N$39  (via drill 0.9 pad 2)
  other vias: 13.97,20.32
N$40  (via drill 0.9 pad 2)
  other vias: 16.51,20.32
N$41  (via drill 0.9 pad 2)
  other vias: 19.05,20.32
N$44  (via drill 0.9 pad 2)
  other vias: 6.35,22.86
N$45  (via drill 0.9 pad 2)
  other vias: 8.89,22.86
N$46  (via drill 0.9 pad 2)
  other vias: 11.43,22.86
N$47  (via drill 0.9 pad 2)
  other vias: 13.97,22.86
N$48  (via drill 0.9 pad 2)
  other vias: 16.51,22.86
N$49  (via drill 0.9 pad 2)
  other vias: 19.05,22.86
N$50  (via drill 0.9 pad 2)
  other vias: 19.05,25.4
N$51  (via drill 0.9 pad 2)
  other vias: 16.51,25.4
N$52  (via drill 0.9 pad 2)
  other vias: 13.97,25.4
N$53  (via drill 0.9 pad 2)
  other vias: 11.43,25.4
N$54  (via drill 0.9 pad 2)
  other vias: 8.89,25.4
N$55  (via drill 0.9 pad 2)
  other vias: 6.35,25.4
N$58  (via drill 0.9 pad 2)
  other vias: 6.35,27.94
N$59  (via drill 0.9 pad 2)
  other vias: 8.89,27.94
N$60  (via drill 0.9 pad 2)
  other vias: 11.43,27.94
N$61  (via drill 0.9 pad 2)
  other vias: 13.97,27.94
N$62  (via drill 0.9 pad 2)
  other vias: 16.51,27.94
N$63  (via drill 0.9 pad 2)
  other vias: 19.05,27.94
N$65  (via drill 0.9 pad 2)
  other vias: 6.35,30.48
N$66  (via drill 0.9 pad 2)
  other vias: 8.89,30.48
N$67  (via drill 0.9 pad 2)
  other vias: 11.43,30.48
N$68  (via drill 0.9 pad 2)
  other vias: 13.97,30.48
N$69  (via drill 0.9 pad 2)
  other vias: 16.51,30.48
N$70  (via drill 0.9 pad 2)
  other vias: 19.05,30.48
N$71  (via drill 0.9 pad 2)
  other vias: 19.05,33.02
N$72  (via drill 0.9 pad 2)
  other vias: 16.51,33.02
N$73  (via drill 0.9 pad 2)
  other vias: 13.97,33.02
N$74  (via drill 0.9 pad 2)
  other vias: 11.43,33.02
N$75  (via drill 0.9 pad 2)
  other vias: 8.89,33.02
N$76  (via drill 0.9 pad 2)
  other vias: 6.35,33.02
N$79  (via drill 0.9 pad 2)
  other vias: 6.35,35.56
N$80  (via drill 0.9 pad 2)
  other vias: 8.89,35.56
N$81  (via drill 0.9 pad 2)
  other vias: 11.43,35.56
N$82  (via drill 0.9 pad 2)
  other vias: 13.97,35.56
N$83  (via drill 0.9 pad 2)
  other vias: 16.51,35.56
N$84  (via drill 0.9 pad 2)
  other vias: 19.05,35.56
N$85  (via drill 0.9 pad 2)
  other vias: 19.05,38.1
N$86  (via drill 0.9 pad 2)
  other vias: 16.51,38.1
N$87  (via drill 0.9 pad 2)
  other vias: 13.97,38.1
N$88  (via drill 0.9 pad 2)
  other vias: 11.43,38.1
N$89  (via drill 0.9 pad 2)
  other vias: 8.89,38.1
N$90  (via drill 0.9 pad 2)
  other vias: 6.35,38.1
N$93  (via drill 0.9 pad 2)
  other vias: 6.35,40.64
N$94  (via drill 0.9 pad 2)
  other vias: 8.89,40.64
N$95  (via drill 0.9 pad 2)
  other vias: 11.43,40.64
N$96  (via drill 0.9 pad 2)
  other vias: 13.97,40.64
N$97  (via drill 0.9 pad 2)
  other vias: 16.51,40.64
N$98  (via drill 0.9 pad 2)
  other vias: 19.05,40.64
ROW1  (via drill 0.3)
  Top 0.203: v97.16,33.66 71.12,33.66 70.48,34.29 U2.15
  Bottom 0.203: U3.22 97.79,33.02 v97.16,33.66
ROW2  (via drill 0.3)
  Top 0.203: v89.53,34.29 71.12,34.29 70.48,34.92 67.94,34.92 67.31,34.29 U2.14
  Bottom 0.203: v89.53,34.29 90.17,33.66 U3.19
ROW3  (via drill 0.3)
  Top 0.203: v81.92,34.92 71.12,34.92 70.48,35.56 U2.16
  Bottom 0.203: U3.16 82.55,34.29 v81.92,34.92
ROW4  (via drill 0.3)
  Top 0.203: v73.66,35.56 71.12,35.56 70.48,36.2 67.94,36.2 67.31,35.56 U2.13
  Bottom 0.203: U3.13 74.93,34.92 74.3,35.56 v73.66,35.56
ROW5  (via drill 0.3)
  Top 0.203: v97.16,40.01 71.75,40.01 70.48,41.27 67.94,41.27 67.31,40.64 U2.9
  Bottom 0.203: U3.3 97.79,40.64 v97.16,40.01
ROW6  (via drill 0.3)
  Top 0.203: v89.53,38.73 71.75,38.73 70.48,40.01 67.94,40.01 67.31,39.37 U2.10
  Bottom 0.203: U3.6 90.17,39.37 v89.53,38.73
ROW7  (via drill 0.3)
  Top 0.203: v81.92,37.47 71.75,37.47 70.48,38.73 67.94,38.73 67.31,38.1 U2.11
  Bottom 0.203: U3.9 82.55,38.1 v81.92,37.47
ROW8  (via drill 0.3)
  Top 0.203: v74.3,36.2 71.75,36.2 70.48,37.47 63.5,37.47 62.87,36.83 U2.12
  Bottom 0.203: U3.12 74.93,36.83 v74.3,36.2
SCL  (via drill 0.3, 0.9 pad 2)
  Top 0.203: U1.6 32.38,35.56 v31.75,34.92 | v32.38,27.62 40.96,27.62 v41.91,26.67 | v41.91,15.24 v26.67,15.24 | R15.1 14.92,3.17 v14.92,5.08
  Bottom 0.203: v32.38,27.62 31.75,28.26 v31.75,34.92 | CN1.1 42.37,14.78 v41.91,15.24 v41.91,26.67 | v26.67,15.24 26.04,14.61 26.04,8.89 22.23,5.08 v14.92,5.08 14.29,5.08 13.65,5.71 13.65,7.62 19.05,7.62 v19.05,10.16 v19.05,12.7
SCLK  (via drill 0.3)
  Top 0.203: U1.9 57.15,35.56 57.78,34.92 v61.59,34.92 | v61.59,41.27 60.96,41.91 U2.8 | v61.59,31.75 R2.1
  Bottom 0.203: v61.59,41.27 v61.59,34.92 v61.59,31.75
SDA  (via drill 0.3, 0.9 pad 2)
  Top 0.203: U1.5 v31.75,38.1 | v31.75,26.99 39.05,26.99 v40.01,26.04 | v40.01,15.88 v28.57,15.88 | R16.1 20.64,3.17 v20.64,4.45
  Bottom 0.203: v31.75,26.99 31.11,27.62 31.11,37.47 v31.75,38.1 | CN1.2 40.37,15.51 v40.01,15.88 v40.01,26.04 | v28.57,15.88 26.67,13.97 26.67,8.89 22.23,4.45 v20.64,4.45 13.97,4.45 13.02,5.4 13.02,8.26 16.51,8.26 v16.51,10.16 v16.51,12.7
SPEAKER  (via drill 0.3)
  Top 0.203: R7.2 v72.39,12.06 | v71.12,17.14 30.48,17.14 v27.3,20.32 | v31.75,48.26 U1.1
  Bottom 0.203: v72.39,12.06 72.39,15.88 v71.12,17.14 | v27.3,20.32 27.3,38.1 29.84,40.64 29.84,46.35 v31.75,48.26
SPEAKER-ENABLE  (via drill 0.3)
  Top 0.203: v90.17,19.68 v35.56,19.68 | U5.1 v93.34,8.26
  Bottom 0.203: v90.17,19.68 91.44,18.41 U4.1 92.08,13.34 93.34,12.06 v93.34,8.26 | v35.56,19.68 34.29,20.95 JP3.3

### Text on the board
tPlace: === label side === | XIAOGYAN v1.1 | Grove-I2C | GND | 3.3V | SDA | SCL | A | B
bPlace: SP | 5V | ENCA | GND | ENCB | 3V3 | SPEN / /AIN | DIN | SDA | A-BTN | SCL | SCLK | LED | B-BTN | 5V | 3V3 | AIN | SPEN